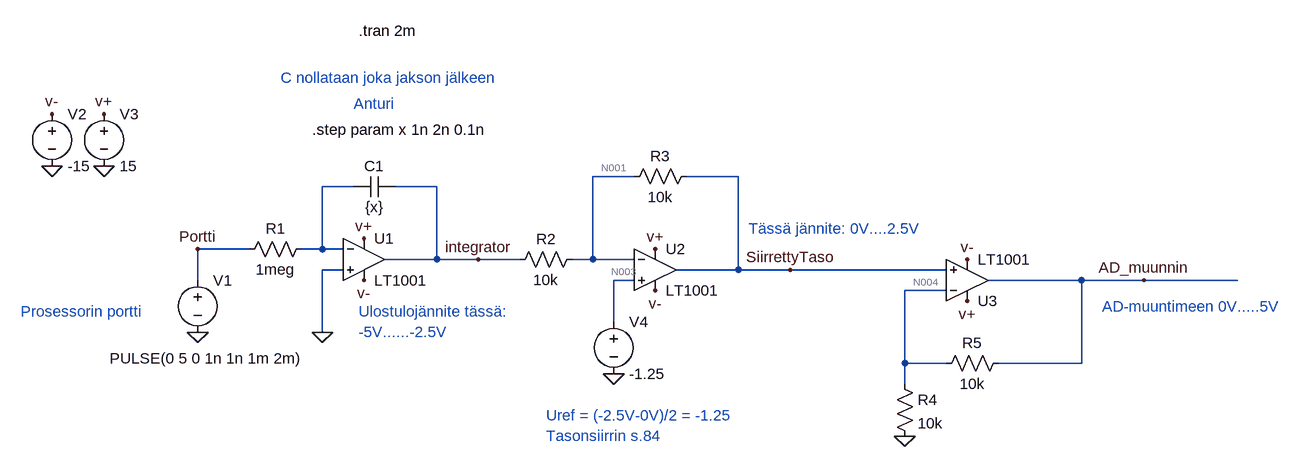
[diagram p0: schematic Kapasitiivinen_anturi.asc]
Kapasitiivinen_anturi.asc, the LTspice schematic file:
Version 4
SHEET 1 1812 680
WIRE 768 16 704 16
WIRE 928 16 848 16
WIRE 336 32 288 32
WIRE 464 32 400 32
WIRE 176 128 96 128
WIRE 288 128 288 32
WIRE 288 128 256 128
WIRE 320 128 288 128
WIRE 464 144 464 32
WIRE 464 144 384 144
WIRE 528 144 464 144
WIRE 592 144 528 144
WIRE 704 144 704 16
WIRE 704 144 672 144
WIRE 768 144 704 144
WIRE 320 160 288 160
WIRE 928 160 928 16
WIRE 928 160 832 160
WIRE 1008 160 928 160
WIRE 1248 160 1008 160
WIRE 96 176 96 128
WIRE 768 176 736 176
WIRE 1456 176 1312 176
WIRE 1552 176 1456 176
WIRE 1696 176 1552 176
WIRE 1248 192 1184 192
WIRE 736 240 736 176
WIRE 288 256 288 160
WIRE 1184 304 1184 192
WIRE 1248 304 1184 304
WIRE 1456 304 1456 176
WIRE 1456 304 1328 304
WIRE 1184 336 1184 304
FLAG -128 0 0
FLAG -48 0 0
FLAG 96 256 0
FLAG 288 256 0
FLAG 352 112 v+
FLAG -48 -80 v+
FLAG 352 176 v-
FLAG -128 -80 v-
FLAG 528 144 integrator
FLAG 736 320 0
FLAG 800 192 v-
FLAG 800 128 v+
FLAG 1008 160 SiirrettyTaso
FLAG 1280 208 v+
FLAG 1280 144 v-
FLAG 1184 416 0
FLAG 1552 176 AD_muunnin
FLAG 96 128 Portti
SYMBOL voltage 96 160 R0
WINDOW 3 -135 136 Left 2
WINDOW 123 0 0 Left 2
WINDOW 39 0 0 Left 2
SYMATTR InstName V1
SYMATTR Value PULSE(0 5 0 1n 1n 1m 2m)
SYMBOL voltage -128 -96 R0
WINDOW 123 0 0 Left 2
WINDOW 39 0 0 Left 2
SYMATTR InstName V2
SYMATTR Value -15
SYMBOL voltage -48 -96 R0
WINDOW 123 0 0 Left 2
WINDOW 39 0 0 Left 2
SYMATTR InstName V3
SYMATTR Value 15
SYMBOL Opamps\\LT1001 352 80 R0
SYMATTR InstName U1
SYMBOL cap 400 16 R90
WINDOW 0 0 32 VBottom 2
WINDOW 3 32 32 VTop 2
SYMATTR InstName C1
SYMATTR Value {x}
SYMBOL res 272 112 R90
WINDOW 0 0 56 VBottom 2
WINDOW 3 32 56 VTop 2
SYMATTR InstName R1
SYMATTR Value 1meg
SYMBOL Opamps\\LT1001 800 96 R0
SYMATTR InstName U2
SYMBOL res 688 128 R90
WINDOW 0 0 56 VBottom 2
WINDOW 3 32 56 VTop 2
SYMATTR InstName R2
SYMATTR Value 10k
SYMBOL res 864 0 R90
WINDOW 0 0 56 VBottom 2
WINDOW 3 32 56 VTop 2
SYMATTR InstName R3
SYMATTR Value 10k
SYMBOL voltage 736 224 R0
WINDOW 123 0 0 Left 2
WINDOW 39 0 0 Left 2
SYMATTR InstName V4
SYMATTR Value -1.25
SYMBOL Opamps\\LT1001 1280 240 M180
SYMATTR InstName U3
SYMBOL res 1168 320 R0
SYMATTR InstName R4
SYMATTR Value 10k
SYMBOL res 1344 288 R90
WINDOW 0 0 56 VBottom 2
WINDOW 3 32 56 VTop 2
SYMATTR InstName R5
SYMATTR Value 10k
TEXT -176 224 Left 2 ;Prosessorin portti
TEXT 272 -56 Left 2 !.step param x 1n 2n 0.1n
TEXT 336 -96 Left 2 ;Anturi
TEXT 224 -136 Left 2 ;C nollataan joka jakson jälkeen
TEXT 344 -208 Left 2 !.tran 2m
TEXT 632 384 Left 2 ;Uref = (-2.5V-0V)/2 = -1.25\nTasonsiirrin s.84
TEXT 344 224 Left 2 ;Ulostulojännite tässä:\n-5V......-2.5V
TEXT 1488 216 Left 2 ;AD-muuntimeen 0V.....5V
TEXT 944 96 Left 2 ;Tässä jännite: 0V....2.5V

The netlist it stands for:
* Kapasitiivinen_anturi.asc
V1 Portti 0 PULSE(0 5 0 1n 1n 1m 2m)
V2 v- 0 -15
V3 v+ 0 15
XU1 0 N002 v+ v- integrator LT1001  ; pins In+ In- V+ V- OUT
C1 integrator N002 {x}
R1 N002 Portti 1meg
XU2 N003 N001 v+ v- SiirrettyTaso LT1001  ; pins In+ In- V+ V- OUT
R2 N001 integrator 10k
R3 SiirrettyTaso N001 10k
V4 N003 0 -1.25
XU3 SiirrettyTaso N004 v+ v- AD_muunnin LT1001  ; pins In+ In- V+ V- OUT
R4 N004 0 10k
R5 AD_muunnin N004 10k
* Prosessorin portti
.step param x 1n 2n 0.1n
* Anturi
* C nollataan joka jakson jälkeen
.tran 2m
* Uref = (-2.5V-0V)/2 = -1.25
* Tasonsiirrin s.84
* Ulostulojännite tässä:
* -5V......-2.5V
* AD-muuntimeen 0V.....5V
* Tässä jännite: 0V....2.5V
.lib LTC.lib
.backanno
.end

* Results of the author's LTspice run, read from the files saved beside the schematic
* Operating Point (first step), zero values left out:
*   x = 1 n
*   V(v-) = -15 V
*   V(v+) = 15 V
*   V(integrator) = -4.194 mV
*   V(n001) = -1.25 V
*   V(n003) = -1.25 V
*   V(siirrettytaso) = -2.496 V
*   V(n004) = -2.496 V
*   V(ad_muunnin) = -4.992 V
*   I(R5) = -249.6 µA
*   I(R4) = -249.6 µA
*   I(R3) = -124.6 µA
*   I(R2) = -124.6 µA
*   I(V4) = 2.277 pA
*   I(V3) = -6.628 mA
*   I(V2) = 6.877 mA
*   Ix(u1:3) = 2.313 mA
*   Ix(u1:4) = -2.188 mA
*   Ix(u1:5) = -124.6 µA
*   Ix(u2:1) = -2.277 pA
*   Ix(u2:2) = -2.187 pA
*   Ix(u2:3) = 2.188 mA
*   Ix(u2:4) = -2.313 mA
*   Ix(u2:5) = 124.6 µA
*   Ix(u3:1) = -4.547 pA
*   Ix(u3:2) = -4.366 pA
*   Ix(u3:3) = 2.127 mA
*   Ix(u3:4) = -2.377 mA
*   Ix(u3:5) = 249.6 µA
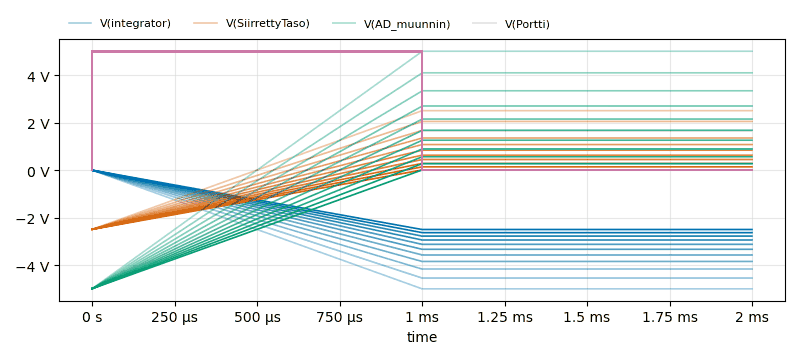
[diagram p1: Transient Analysis of Kapasitiivinen_anturi.asc, plotted from the saved traces]
* Transient Analysis, 21 runs:
*   V(integrator) [run 1]: min -5.003 V, max -4.028 mV, average -3.753 V, rms 4.148 V, last -5.003 V
*   V(integrator) [run 2]: -4.194 mV at time=0 s, -4.194 mV at time=0 s, min -4.194 mV, max -4.194 mV
*   V(integrator) [run 3]: min -4.549 V, max -4.028 mV, average -3.412 V, rms 3.772 V, last -4.549 V
*   V(integrator) [run 4]: min -4.17 V, max -4.028 mV, average -3.128 V, rms 3.458 V, last -4.17 V
*   V(integrator) [run 5]: -4.194 mV at time=0 s, -4.194 mV at time=0 s, min -4.194 mV, max -4.194 mV
*   V(integrator) [run 6]: min -3.85 V, max -4.028 mV, average -2.888 V, rms 3.191 V, last -3.85 V
*   V(integrator) [run 7]: min -3.575 V, max -4.028 mV, average -2.682 V, rms 2.965 V, last -3.575 V
*   V(integrator) [run 8]: -4.194 mV at time=0 s, -4.194 mV at time=0 s, min -4.194 mV, max -4.194 mV
*   V(SiirrettyTaso) [run 1]: min -2.496 V, max 2.503 V, average 1.252 V, rms 2.166 V, last 2.503 V
*   V(SiirrettyTaso) [run 2]: -2.496 V at time=0 s, -2.496 V at time=0 s, min -2.496 V, max -2.496 V
*   V(SiirrettyTaso) [run 3]: min -2.496 V, max 2.049 V, average 911.4 mV, rms 1.848 V, last 2.049 V
*   V(SiirrettyTaso) [run 4]: min -2.496 V, max 1.67 V, average 627.5 mV, rms 1.601 V, last 1.67 V
*   V(SiirrettyTaso) [run 5]: -2.496 V at time=0 s, -2.496 V at time=0 s, min -2.496 V, max -2.496 V
*   V(SiirrettyTaso) [run 6]: min -2.496 V, max 1.35 V, average 387.3 mV, rms 1.413 V, last 1.35 V
*   V(SiirrettyTaso) [run 7]: min -2.496 V, max 1.075 V, average 181.4 mV, rms 1.277 V, last 1.075 V
*   V(SiirrettyTaso) [run 8]: -2.496 V at time=0 s, -2.496 V at time=0 s, min -2.496 V, max -2.496 V
*   V(AD_muunnin) [run 1]: min -4.992 V, max 5.007 V, average 2.502 V, rms 4.333 V, last 5.006 V
*   V(AD_muunnin) [run 2]: -4.992 V at time=0 s, -4.992 V at time=0 s, min -4.992 V, max -4.992 V
*   V(AD_muunnin) [run 3]: min -4.992 V, max 4.098 V, average 1.821 V, rms 3.696 V, last 4.098 V
*   V(AD_muunnin) [run 4]: min -4.992 V, max 3.341 V, average 1.254 V, rms 3.203 V, last 3.34 V
*   V(AD_muunnin) [run 5]: -4.992 V at time=0 s, -4.992 V at time=0 s, min -4.992 V, max -4.992 V
*   V(AD_muunnin) [run 6]: min -4.992 V, max 2.7 V, average 773.2 mV, rms 2.826 V, last 2.7 V
*   V(AD_muunnin) [run 7]: min -4.992 V, max 2.15 V, average 361.4 mV, rms 2.554 V, last 2.15 V
*   V(AD_muunnin) [run 8]: -4.992 V at time=0 s, -4.992 V at time=0 s, min -4.992 V, max -4.992 V
*   V(Portti) [run 1]: min 0 V, max 5 V, average 2.5 V, rms 3.536 V, last 0 V
*   V(Portti) [run 2]: 0 V at time=0 s, 0 V at time=0 s, min 0 V, max 0 V
*   V(Portti) [run 3]: min 0 V, max 5 V, average 2.5 V, rms 3.536 V, last 0 V
*   V(Portti) [run 4]: min 0 V, max 5 V, average 2.5 V, rms 3.536 V, last 0 V
*   V(Portti) [run 5]: 0 V at time=0 s, 0 V at time=0 s, min 0 V, max 0 V
*   V(Portti) [run 6]: min 0 V, max 5 V, average 2.5 V, rms 3.536 V, last 0 V
*   V(Portti) [run 7]: min 0 V, max 5 V, average 2.5 V, rms 3.536 V, last 0 V
*   V(Portti) [run 8]: 0 V at time=0 s, 0 V at time=0 s, min 0 V, max 0 V